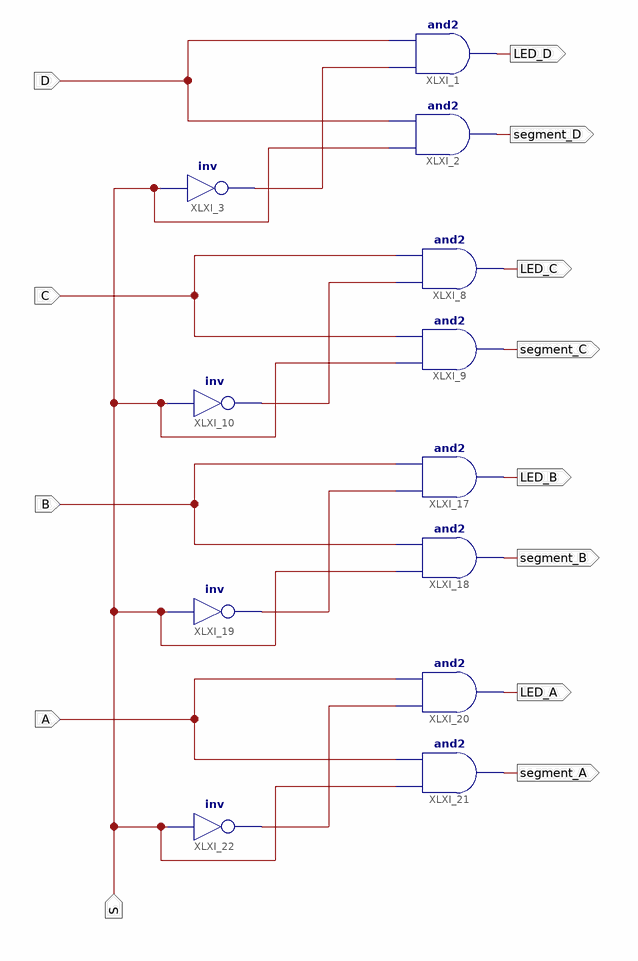
[diagram p0: schematic sheet 1]
// Xilinx ISE schematic four2to1DMUX.sch (spartan6) as structural Verilog: 12 symbols, 13 ports
module four2to1DMUX (
  input  D,
  input  C,
  input  B,
  input  A,
  input  S,
  output LED_D,
  output segment_D,
  output LED_C,
  output segment_C,
  output LED_B,
  output segment_B,
  output LED_A,
  output segment_A
);

  wire XLXN_9, XLXN_15, XLXN_33, XLXN_39;

  and XLXI_1 (LED_D, XLXN_9, D);
  and XLXI_2 (segment_D, S, D);
  not XLXI_3 (XLXN_9, S);
  and XLXI_8 (LED_C, XLXN_15, C);
  and XLXI_9 (segment_C, S, C);
  not XLXI_10 (XLXN_15, S);
  and XLXI_17 (LED_B, XLXN_33, B);
  and XLXI_18 (segment_B, S, B);
  not XLXI_19 (XLXN_33, S);
  and XLXI_20 (LED_A, XLXN_39, A);
  and XLXI_21 (segment_A, S, A);
  not XLXI_22 (XLXN_39, S);
endmodule
